# Altium project Gateway_V1.PrjPcb
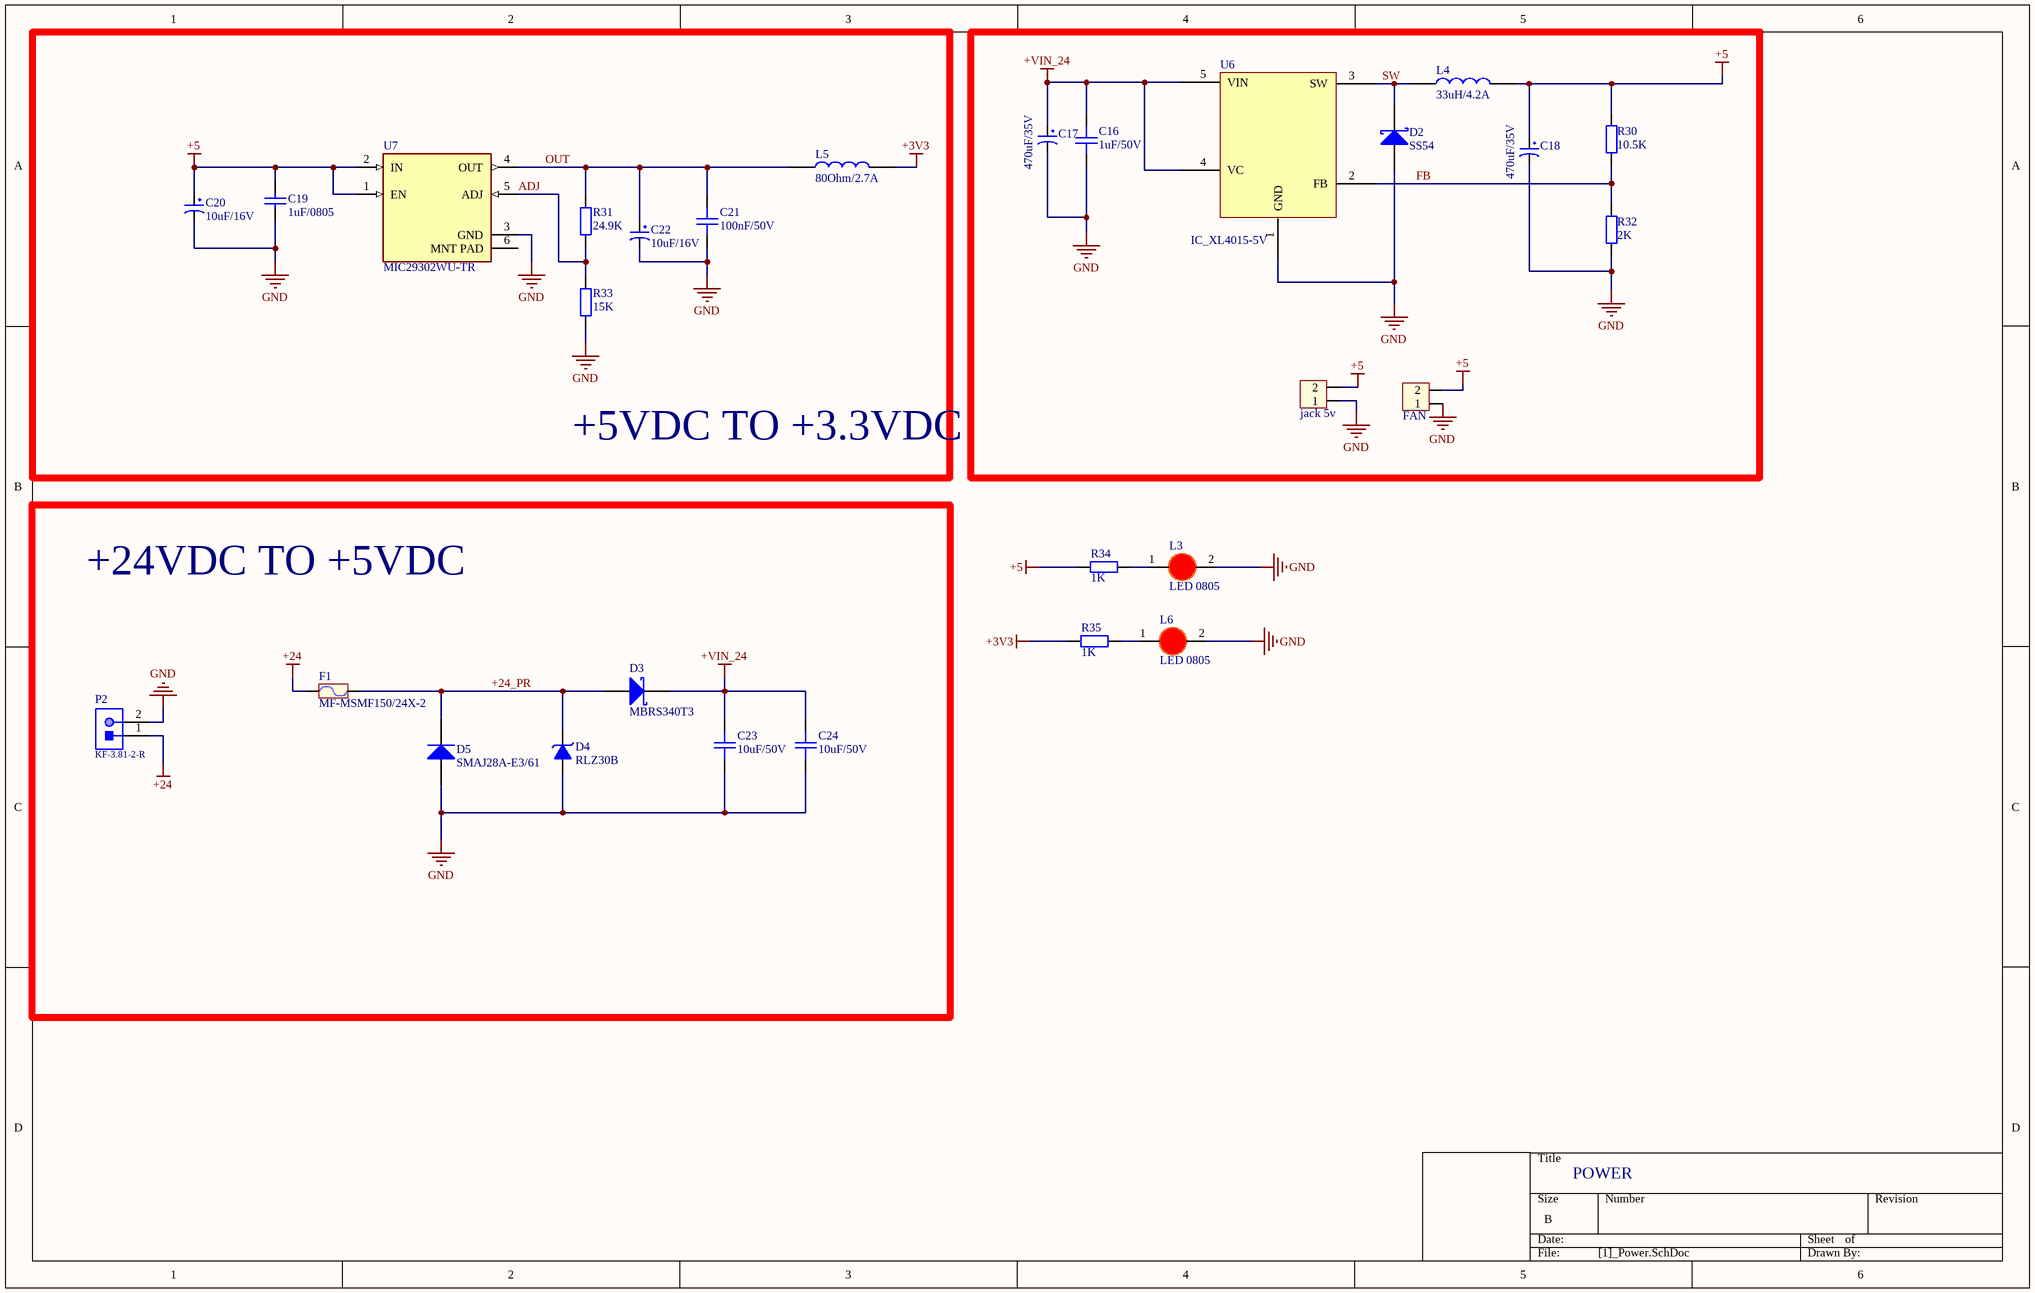
[diagram p0: [1]_Power.SchDoc]
4 sheets, 108 parts. Net scope: global (net labels, ports and power ports of the same name join across sheets).
Board file: PCB_Gateway.PcbDoc
Sheets:
  [1]_Power.SchDoc
  [2]_ARM.SchDoc
  [3]_I2C_TO_UART.SchDoc
  [4]_SIM.SchDoc

## Sheet [1]_Power.SchDoc
size B

### Parts
C16  1uF/50V  [1206]
C17  470uF/35V  [CAP_10_10]
C18  470uF/35V  [CAP_10_10]
C19  1uF/0805  [tu 0805]
C20  10uF/16V  [2312]
C21  100nF/50V  [C0805]
C22  10uF/16V  [2312]
C23  10uF/50V  [1210]
C24  10uF/50V  [1210]
D2  SS54  [DO-SMB-2]
D3  MBRS340T3  [DO214AB_SMC]
D4  RLZ30B  [SOD_80]
D5  SMAJ28A-E3/61  [VISH-DO-214AC-2_L]
F1  MF-MSMF150/24X-2  [1812]
H1  jack 5v  [VH3.96M-2]
H2  FAN  [XH2.54M-2]
L3  LED 0805  [LED-0805-Red]
L4  33uH/4.2A  [IND-12_12_8]
L5  80Ohm/2.7A  [FER-0805 (2012)]
L6  LED 0805  [LED-0805-Red]
P2  KF-3.81-2-R  [691322310002]
R30  10.5K  [R1206]
R31  24.9K  [tro smd 0805]
R32  2K  [R0805]
R33  15K  [tro smd 0805]
R34  1K  [R0805]
R35  1K  [R0805]
U6  IC_XL4015-5V  [TO-263-5]
U7  MIC29302WU-TR  [FP-C04-012-MFG]

### Blocks framed on the sheet
+5VDC TO +3.3VDC: C19-C22 L5 R31 R33 U7
+24VDC TO +5VDC: C23 C24 D3-D5 F1 P2

### Nets
+3V3: L5.2 R35.2
+5: C18.1 C19.1 C20.1 H1.2 H2.2 L4.2 R30.1 R34.2 U7.1(EN) U7.2(IN)
+24: F1.1 P2.1
+VIN_24: C16.2 C17.1 C23.2 C24.2 D3.2(K) U6.4(VC) U6.5(VIN)
GND: C16.1 C17.2 C18.2 C19.2 C20.2 C21.1 C22.2 C23.1 C24.1 D2.1(A) D4.1(A) D5.2(A) H1.1 H2.1 L3.2(K) L6.2(K) P2.2 R32.1 R33.1 U6.1(GND) U7.3(GND)
+24_PR: D3.1(A) D4.2(K) D5.1(K) F1.2
ADJ: R31.1 R33.2 U7.5(ADJ)
FB: R30.2 R32.2 U6.2(FB)
OUT: C21.2 C22.1 L5.1 R31.2 U7.4(OUT)
SW: D2.2(K) L4.1 U6.3(SW)
NetL3_1: L3.1(A) R34.1
NetL6_1: L6.1(A) R35.1

Not connected (* = marked no-connect by the designer): U7 6(MNT_PAD)

### Notes on the sheet
- POWER

### Library data of the parts
C16 = CAP_CER_1206_1uF: CAP CER 10uF/50V 1206; Manufacturer: Samsung; Part number: C1206; Cost: 500; ComponentLink1Description: Link product; ComponentLink1URL: https://www.thegioiic.com/tu-gom-1206-1uf-50v; Package: 1206
C17 C18 = CAP_ALUM_10_10_33uF/100V: CAP ALUM 33uF/100V 10x10.5; Manufacturer: OEM; Part number: ALUM_33uF; Cost: 2900; ComponentLink1Description: Link product; ComponentLink1URL: https://www.thegioiic.com/tu-nhom-smd-33uf-100v-10x10-5mm; Package: 10x10.5
C19 = Tu 0805 104 50V 10%: Dán; Don_Vi: Con; So_Chan: 2; Ten_Linh_Kien: Tụ 0805 104-100nF 10% 50V; Ma_Hang: MH004551; Chung_Loai: Dán; Kieu_Chan: *; ComponentLink1Description: New link; ComponentLink1URL: https://www.thegioiic.com/tu-gom-0805-1uf-25v
C20 C22 = CAP_TANT_2312_100uF: CAP TANT 100uF/10V 2312; Manufacturer: AVX; Part number: TAJC107K010RNJ; Cost: 5000; ComponentLink1Description: Link product; ComponentLink1URL: https://www.thegioiic.com/tu-tantalum-100uf-10v-2312-tajc107k010rnj; Package: 2312
C21 = CAP_CER_0805_100nF: CAP CER 100nF/50V 0805; Manufacturer: Samsung; Cost: 190; Part number: C0805; ComponentLink1Description: Link product; ComponentLink1URL: https://www.thegioiic.com/tu-gom-0805-100nf-0-1uf-50v; Package: 0805
C23 C24 = CAP_CER_1210_10uF: CAP CER 10uF/50V 1210; Manufacturer: Yageo; Part number: C1210; Cost: 3400; ComponentLink1Description: Link product; ComponentLink1URL: https://www.thegioiic.com/tu-gom-1210-10uf-50v; Package: 1210
D2 = DIO_SS54: DIODE SCHOTTKY 5A 40V SMB; Manufacturer: Vishay; Cost: 1800; Part number: SS54; Package: SMB; ComponentLink1Description: Link product; ComponentLink1URL: https://www.thegioiic.com/ss54-smb
D3 = DIO_MBRS340T3: DIODE SCHOTTKY 4A 40V SMC DO-214AB; Manufacturer: Fairchild; Part number: SS14; Cost: 2000; Package: DO-214AB; ComponentLink1Description: Link product; ComponentLink1URL: https://www.thegioiic.com/mbrs340t3-diode-schottky-4a
D4 = DIO_ZMM15: ZMM15 15V 500mW SMD SOD-80; Manufacturer: On Semiconductor; Cost: 250; Part number: ZMM15; Package: SOD-80 2L; ComponentLink1Description: Link product; ComponentLink1URL: https://www.thegioiic.com/rlz30b-diode-zener-27-70-29-13v-500mw-smd
D5 = CMP-0548-00227-2: Transient Voltage Suppressor, 6.40 to 231 V, 28 V Stand-off Voltage, Uni-Directional, -55 to 155 degC, 2-pin DO-214AC, Pb-Free, Tape and Reel; Manufacturer: Vishay Semiconductor; IFSM: 40 A; VBR Uni-Directional (V): 6.4 to 231; ID (uA): 1; VWM (V): 28; PPPM (W): 400, 300; PackageReference: DO-214AC-2; Packing: Tape and Reel; RoHS: TRUE; PartNumber: SMAJ28A-E3/61; PackageDescription: 2-Pin DO-214AC (SMA), Body 4.245 x 2.665 mm; Mounting Technology: Surface Mount; DatasheetVersion: 12/8/2013; Operating Junction and Storage Temperature Range: -55 to 150 degC; ComponentLink4Description: New link; ComponentLink4URL: https://www.thegioiic.com/smaj28a-e3-61-tvs-diode-28v-45-4v-do214ac
F1 = FUSE_16V_2.5A: MF-MSMF250/16 16V 2.5A1812; Manufacturer: Bourns; Cost: 3000; Part number: 1812; ComponentLink1Description: Link product; ComponentLink1URL: https://www.thegioiic.com/mf-msmf150-24x-2-cau-chi-tu-phuc-hoi-1812-24v-1-5a; Package: 1812
H1 = Header 2P VH3.96 Duc Thang: Cắm; Ten_Linh_Kien: Header 2P XH2.54-2P Đực Thẳng; Don_Vi: Con; Ma_Hang: MH001283; Chung_Loai: Cắm
H2 = Header 2P 2.54 Duc Thang: Cắm; Ten_Linh_Kien: Header 2P XH2.54-2P Đực Thẳng; Don_Vi: Con; Ma_Hang: MH001283; Chung_Loai: Cắm
L3 L6 = LED 0805 Do: Dán; Don_Vi: Con; Ma_Hang: MH000897; Ten_Linh_Kien: LED 0805 Màu Đỏ (Red); Ghi_Chu: *; Kieu_Chan: *; Chung_Loai: Dán
L4 = IND_33uH_4.2A_1280: CDRH127 IND 33uH 4.2A 12x12x8; Manufacturer: OEM; Cost: 3200; Part number: CDRH127; Package: 1280; ComponentLink1Description: Link product; ComponentLink1URL: https://www.thegioiic.com/cdrh127-cuon-cam-dan-smd-1280-330-33uh-4-2a
L5 = FERRITE_BEAD_2.7A_80: FERRITE BEAD 2.7A 80 OHM 0805; Manufacturer: Taiyo Yuden; Part number: FBMH2012HM800-T; Cost: 2000; Package: 0805; ComponentLink1Description: Link product; ComponentLink1URL: https://www.thegioiic.com/fbmh2012hm800-t-ferrite-bead-80-ohm-0805
P2 = CMP-1502-01886-1: Serie 322 - 3.81mm Horizontal PCB Header WR-TBL, 2 pin; Manufacturer: Wurth Elektronik; Gender: Male; Pin Number: 2; Publisher: WurthElektronik; Pitch: 3.81mm; Packaging: Box; Part Number: 691322310002; Manufacturer URL: http://www.we-online.de; Operating Temperature: -40to105degC; Mounting Technology: THT; Datasheet URL: http://katalog.we-online.de/em/datasheet/6913223100xx.pdf; Package Reference: 691322310002
R30 = RES_1206_3.3K: RES 1206 3.3K; Manufacturer: OEM; Cost: 116; Part number: R1206; ComponentLink1Description: Link product; ComponentLink1URL: https://www.thegioiic.com/dien-tro-3-3-kohm-1206-1-; Package: 1206
R31 = Tro 0805 5% 20k: Dán; Don_Vi: Con; So_Chan: 2; Ten_Linh_Kien: Trở 0805 5% 20k; Ma_Hang: MH005247; Chung_Loai: Dán; Kieu_Chan: *; ComponentLink1Description: New link; ComponentLink1URL: https://www.thegioiic.com/dien-tro-100-kohm-0805-1
R32 R34 R35 = RES_0805_0K: RES 0805 0K; Manufacturer: OEM; Cost: 48; Part number: R0805; ComponentLink1Description: Link product; ComponentLink1URL: https://www.thegioiic.com/dien-tro-2-kohm-0805-1; Package: 0805
R33 = Tro 0805 5% 47k: Dán; Don_Vi: Con; So_Chan: 2; Ten_Linh_Kien: Trở 0805 5% 47k; Ma_Hang: MH005320; Chung_Loai: Dán; Kieu_Chan: *; ComponentLink1Description: New link; ComponentLink1URL: https://www.thegioiic.com/dien-tro-43-kohm-0805-5
U6 = IC_XL4015-5V: XL4015E1 Buck converter 5A TO 263; Manufacturer: XLSEMI; Cost: 16000; Part number: XL4015E1; ComponentLink1Description: Link product; ComponentLink1URL: https://www.thegioiic.com/xl4015e1-ic-dieu-chinh-giam-ap-5a-to-263-5; Package: TO-263-5
U7 = CMP-06324-000007-1: IC REG LINEAR POS ADJ 3A TO263-5; Manufacturer: Microchip; Output Voltage: 3.3-12V; Output Type: AdjustableProgrammable; Max Junction Temp: +125°C; Standoff Height: 0mm; Accuracy Percentage: 1%; Max Supply Voltage: 26V; Nominal Supply Current: 10-37mA; Number Of Outputs: 1; Dropout Voltage: 370mV; Min Supply Voltage: 2.25V; Device Class L1: Integrated Circuits (ICs); Digikey Description: IC REG LINEAR POS ADJ 3A TO263-5; Device Class L2: Power Management ICs; Lead Free: Yes; Mouser Description: LDO Voltage Regulators; Package: C04-012; Temperature: -40°C to +125°C; Temperature Range High: +125°C; Automotive: No; Device Class L3: Voltage Regulators - Linear; Category: IC; Temperature Range Low: -40°C; RoHS: TRUE; Output Current: 3A; Octopart: https://octopart.com/mic29302wu-tr-microchip-66801318; Manufacturer Part Number: MIC29302WU-TR; Height: 0.2inch; ComponentLink3Description: New link; ComponentLink3URL: https://www.thegioiic.com/mic29302-ic-dieu-chinh-dien-ap-3a

## Sheet [2]_ARM.SchDoc
size B
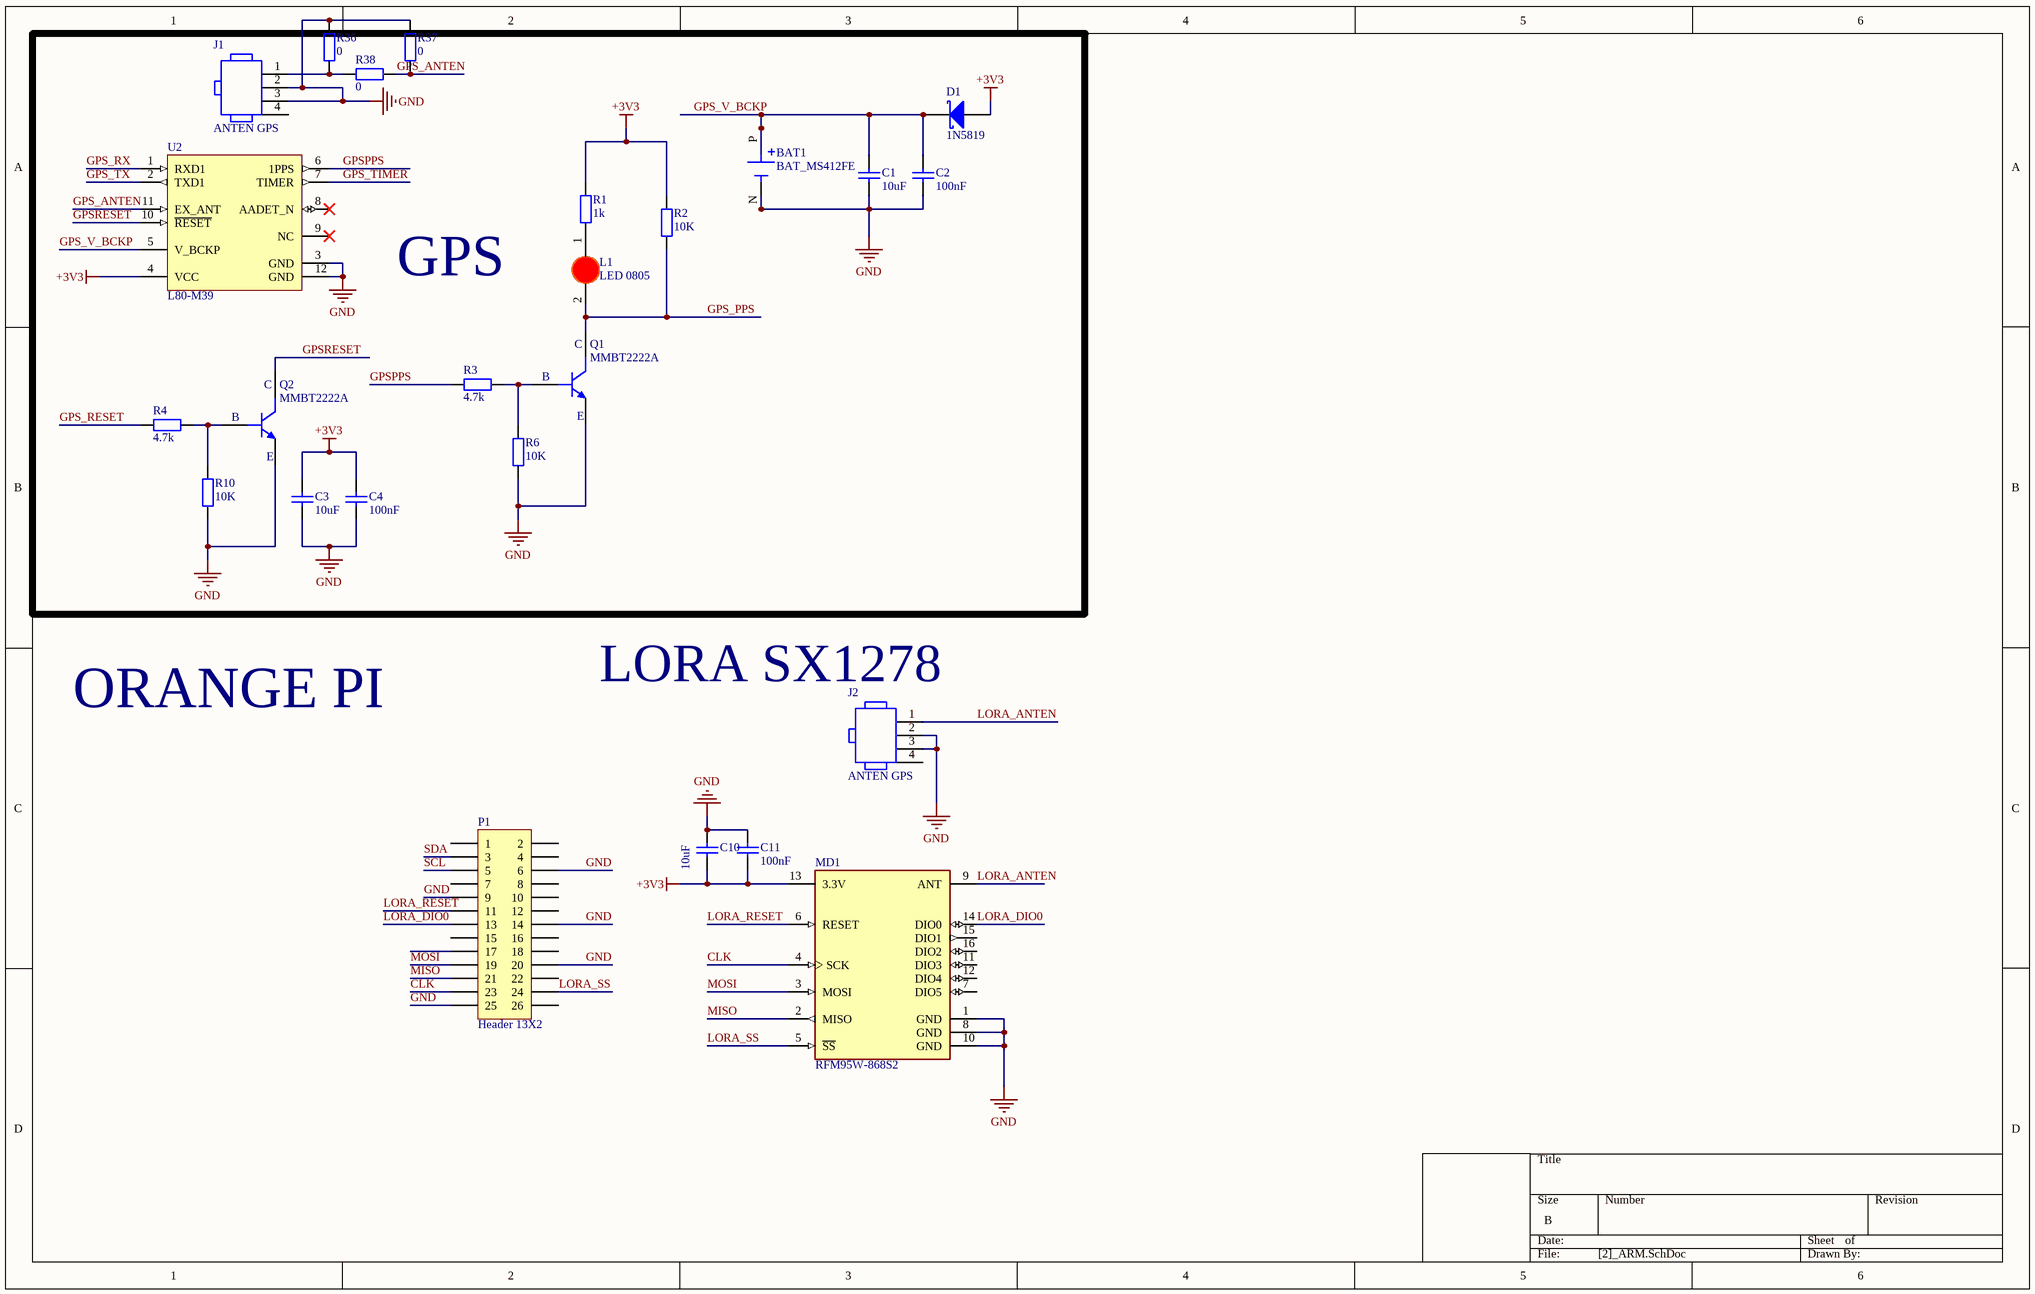
[diagram p1: [2]_ARM.SchDoc]

### Parts
BAT1  BAT_MS412FE  [MS412FE]
C1  10uF  [tu 0603]
C2  100nF  [tu 0603]
C3  10uF  [tu 0603]
C4  100nF  [tu 0603]
C10  10uF  [tu 0603]
C11  100nF  [tu 0603]
D1  1N5819  [DO-214AA]
J1  ANTEN GPS  [TG-RECE-20369-001E-4_V]
J2  ANTEN GPS  [TG-RECE-20369-001E-4_V]
L1  LED 0805  [LED-0805-Red]
MD1  RFM95W-868S2  [FP-RFM95W-868S2-MFG]
P1  Header 13X2  [HDR2X13]
Q1  MMBT2222A  [SOT_23_3]
Q2  MMBT2222A  [SOT_23_3]
R1  1k  [tro smd 0603]
R2  10K  [tro smd 0603]
R3  4.7k  [tro smd 0603]
R4  4.7k  [tro smd 0603]
R6  10K  [tro smd 0603]
R10  10K  [tro smd 0603]
R36  0  [tro smd 0603]
R37  0  [tro smd 0603]
R38  0  [tro smd 0603]
U2  L80-M39  [QUEC-L80-M39-12_V]

### Blocks framed on the sheet
GPS: BAT1 C1-C4 D1 J1 L1 Q1 Q2 R1-R4 R6 R10 R36-R38 U2

### Nets
+3V3: C3.2 C4.1 C10.2 C11.2 D1.1(A) MD1.13(3.3V) R1.2 R2.2 U2.4(VCC)
GND: BAT1.N(NEG) C1.1 C2.2 C3.1 C4.2 C10.1 C11.1 J1.2 J1.3 J2.2 J2.3 MD1.1(GND) MD1.8(GND) MD1.10(GND) P1.6 P1.9 P1.14 P1.20 P1.25 Q1.2(E) Q2.2(E) R6.1 R10.1 R36.2 R37.2 U2.3(GND) U2.12(GND)
CLK: MD1.4(SCK) P1.23
GPS_ANTEN: R37.1 R38.1 U2.11(EX_ANT)
GPS_PPS: L1.2(K) Q1.3(C) R2.1
GPS_RESET: R4.1
GPS_RX: U2.1(RXD1)
GPS_TIMER: U2.7(TIMER)
GPS_TX: U2.2(TXD1)
GPS_V_BCKP: BAT1.P(POS) C1.2 C2.1 D1.2(K) U2.5(V_BCKP)
GPSPPS: R3.1 U2.6(1PPS)
GPSRESET: Q2.3(C) U2.10(~{RESET})
LORA_ANTEN: J2.1 MD1.9(ANT)
LORA_DIO0: MD1.14(DIO0) P1.13
LORA_RESET: MD1.6(RESET) P1.11
LORA_SS: MD1.5(~{SS}) P1.24
MISO: MD1.2(MISO) P1.21
MOSI: MD1.3(MOSI) P1.19
SCL: P1.5
SDA: P1.3
NetJ1_1: J1.1 R36.1 R38.2
NetL1_1: L1.1(A) R1.1
NetQ1_1: Q1.1(B) R3.2 R6.2
NetQ2_1: Q2.1(B) R4.2 R10.2

Not connected (* = marked no-connect by the designer): J1 4; J2 4; MD1 7(DIO5) 11(DIO3) 12(DIO4) 15(DIO1) 16(DIO2); P1 1 2 4 7 8 10 12 15 16 17 18 22 26; U2 8(AADET_N)* 9(NC)*

### Notes on the sheet
- (near J2) LORA SX1278
- ORANGE PI

### Library data of the parts
C1 C3 C10 = Tu 0603 105 16V 20%: Dán; Don_Vi: Con; So_Chan: 2; Ten_Linh_Kien: Tụ 0603 105-1uF 20% 16V; Ma_Hang: MH004574; Chung_Loai: Dán; Kieu_Chan: *
C2 C4 C11 = Tu 0603 104 50V 10%: Dán; Don_Vi: Con; So_Chan: 2; Ten_Linh_Kien: Tụ 0603 104-100nF 10% 50V; Ma_Hang: MH004568; Chung_Loai: Dán; Kieu_Chan: *
D1 = DIO_SS14: DIODE SCHOTTKY 1A 40V SMA DO-214AA; Manufacturer: Fairchild; Part number: SS14; Cost: 600; Package: DO-214AA; ComponentLink1Description: Link product; ComponentLink1URL: https://www.thegioiic.com/ss14-sma-diode-schottky-1a-1n5819
J1 J2 = CMP-0275-00001-2: RF Connector, Onboard Receptacle, IPEX MHFIII; Manufacturer: Taoglas; PartNumber: RECE-20369-001E-01; Packing: Tape and Reel; Mounting Technology: Surface Mount; PackageReference: RECE-20369-001E-01-4; ComponentLink1URL: http://www.taoglas.com/; Housing Color: Gold; DatasheetVersion: Rev. C; ComponentLink2URL: http://www.taoglas.com/images/product_images/original_images/RECE.20369.001E.01.pdf; ComponentLink3Description: Package Specification; PackageVersion: Rev. C; ComponentLink1Description: Manufacturer URL; ComponentLink2Description: Datasheet; PackageDescription: 4-Pin, Hand Drawn, Body 1.7x1.7mm; ComponentLink3URL: http://www.taoglas.com/images/product_images/original_images/RECE.20369.001E.01.pdf
L1 = LED 0805 Do: as L3 on sheet [1]_Power; Ghi_Chu: *; Kieu_Chan: *; Chung_Loai: Dán
MD1 = CMP-204316-000001-1: RX TXRX MODULE ISM < 1GHZ SMD; Data Rate: 300Kbps; Frequency: 868MHz; Sensitivity: -123dBm; Interface: SPI; Current - Transmitting: 120mA; Current - Receiving: 12.1mA; Max Operating Temperature: 70°C; Case/Package: SMD/SMT; Packaging: Bulk; Mount: Surface Mount; Min Operating Temperature: -20°C
P1 = Header 13X2: Header, 13-Pin, Dual row; LatestRevisionDate: 17-Jul-2002; LatestRevisionNote: Re-released for DXP Platform.; Publisher: Altium Limited
Q1 Q2 = BJT_NPN_MMBT2222A: MMBT2222A NPN 40V 0.6A; Manufacturer: OEM; Cost: 500; Part number: MMBT2222A; ComponentLink1Description: Link product; ComponentLink1URL: https://www.thegioiic.com/mmbt2222a-transistor-npn-40v-0-6a-3-chan-sot-23; Package: SOT-23
R1-R4 R6 R10 R36-R38 = Tro 0603 1% 4.3 k: Dán; Don_Vi: Con; So_Chan: 2; Ten_Linh_Kien: Trở 0603 1% 4.3k; Ma_Hang: MH008715; Chung_Loai: Dán; Kieu_Chan: *
U2 = CMP-2000-05325-1: GPS Module L80 Hardware Design, 1575.42 MHz, 3 to 4.3 V, -40 to 85 degC, 12-Pin SMD, RoHS, Tape and Reel; Manufacturer: Quectel; Maximum Operating Supply Voltage: 4.3V; Screening Level: ExtendedIndustrial; Typical Operating Supply Voltage: 3.3V; Minimum Operating Supply Voltage: 3V; Manufacturer URL: http://www.quectel.com/; Mounting: SurfaceMount; Maximum Operating Frequency: 1575.42MHz; Datasheet Version: Rev. V1.1, 08/2013; Datasheet URL: http://www.quectel.com/uploadimage/downlad/l80_hardware_design_v1.1.pdf

## Sheet [3]_I2C_TO_UART.SchDoc
size B
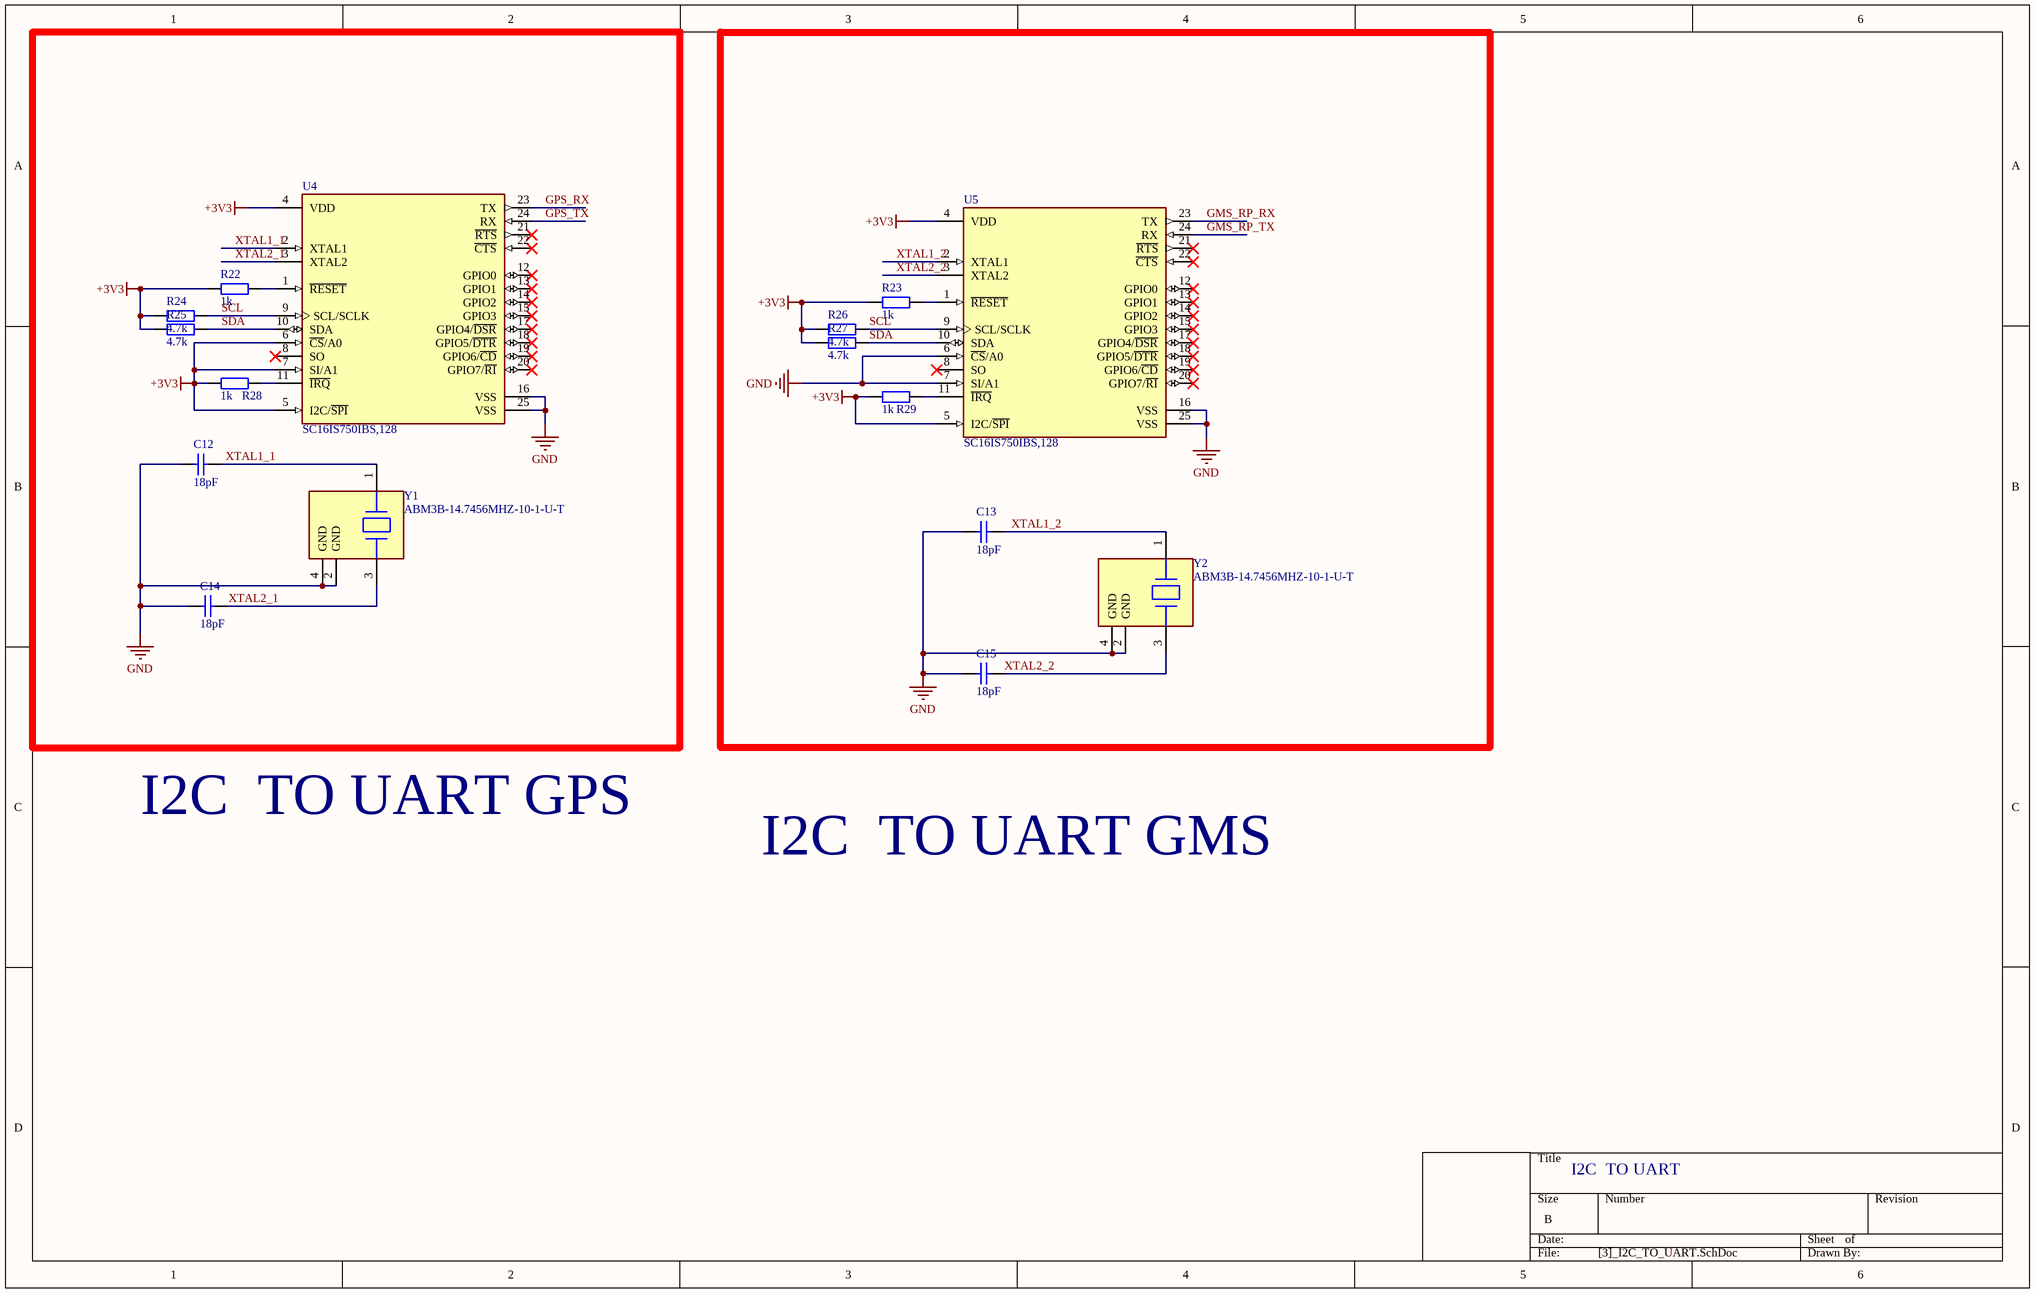
[diagram p2: [3]_I2C_TO_UART.SchDoc]

### Parts
C12  18pF  [tu 0603]
C13  18pF  [tu 0603]
C14  18pF  [tu 0603]
C15  18pF  [tu 0603]
R22  1k  [tro smd 0603]
R23  1k  [tro smd 0603]
R24  4.7k  [tro smd 0603]
R25  4.7k  [tro smd 0603]
R26  4.7k  [tro smd 0603]
R27  4.7k  [tro smd 0603]
R28  1k  [tro smd 0603]
R29  1k  [tro smd 0603]
U4  SC16IS750IBS,128  [FP-SOT616-3-MFG]
U5  SC16IS750IBS,128  [FP-SOT616-3-MFG]
Y1  ABM3B-14.7456MHZ-10-1-U-T  [FP-ABM3B-MFG]
Y2  ABM3B-14.7456MHZ-10-1-U-T  [FP-ABM3B-MFG]

### Nets
+3V3: R22.1 R23.1 R24.1 R25.1 R26.1 R27.1 R28.1 R29.1 U4.4(VDD) U4.5(I2C/~{SPI}) U4.6(~{CS}/A0) U4.7(SI/A1) U5.4(VDD) U5.5(I2C/~{SPI})
GND: C12.2 C13.2 C14.2 C15.2 U4.16(VSS) U4.25(VSS) U5.6(~{CS}/A0) U5.7(SI/A1) U5.16(VSS) U5.25(VSS) Y1.2(GND) Y1.4(GND) Y2.2(GND) Y2.4(GND)
GMS_RP_RX: U5.23(TX)
GMS_RP_TX: U5.24(RX)
GPS_RX: U4.23(TX)
GPS_TX: U4.24(RX)
SCL: R24.2 R26.2 U4.9(SCL/SCLK) U5.9(SCL/SCLK)
SDA: R25.2 R27.2 U4.10(SDA) U5.10(SDA)
XTAL1_1: C12.1 U4.2(XTAL1) Y1.1
XTAL1_2: C13.1 U5.2(XTAL1) Y2.1
XTAL2_1: C14.1 U4.3(XTAL2) Y1.3
XTAL2_2: C15.1 U5.3(XTAL2) Y2.3
NetR22_2: R22.2 U4.1(~{RESET})
NetR23_2: R23.2 U5.1(~{RESET})
NetR28_2: R28.2 U4.11(~{IRQ})
NetR29_2: R29.2 U5.11(~{IRQ})

Not connected (* = marked no-connect by the designer): U4 8(SO)* 12(GPIO0)* 13(GPIO1)* 14(GPIO2)* 15(GPIO3)* 17(GPIO4/~{DSR})* 18(GPIO5/~{DTR})* 19(GPIO6/~{CD})* 20(GPIO7/~{RI})* 21(~{RTS})* 22(~{CTS})*; U5 8(SO)* 12(GPIO0)* 13(GPIO1)* 14(GPIO2)* 15(GPIO3)* 17(GPIO4/~{DSR})* 18(GPIO5/~{DTR})* 19(GPIO6/~{CD})* 20(GPIO7/~{RI})* 21(~{RTS})* 22(~{CTS})*

### Notes on the sheet
- I2C  TO UART GPS
- I2C  TO UART GMS
- I2C  TO UART

### Library data of the parts
C12-C15 = Tu 0603 22pF 50V 10%: Dán; Don_Vi: Con; So_Chan: 2; Ten_Linh_Kien: Tụ 0603 22pF 50V 10%; Ma_Hang: MH004570; Chung_Loai: Dán; Kieu_Chan: *
R22-R29 = Tro 0603 1% 1k: Dán; So_Chan: 2; Don_Vi: Con; Ten_Linh_Kien: Trở 0603 1% 1k; Ma_Hang: MH006334; Chung_Loai: Dán; Kieu_Chan: *
U4 U5 = CMP-1651-00009-2: IC UART I2C/SPI 24-HVQFN; Max Supply Voltage: 3.6V; Data Rate: 5Mbps; Max Supply Current: 6mA; Memory Size: 64B; Min Supply Voltage: 2.3V; Operating Supply Voltage: 3.3V; Number of Channels: 1; Min Operating Temperature: -40°C; Mount: Surface Mount; Lead Free: Lead Free; Nominal Supply Current: 6mA; Number of Pins: 24; Max Operating Temperature: 95°C; Packaging: Tape and Reel; Package Quantity: 1500; Radiation Hardening: No; Operating Supply Current: 6mA
Y1 Y2 = CMP-27762-009747-1: Crystal 14.7456MHz ±10ppm 10pF SMD-4 5mm x 3.2mm; ESR (Equivalent Series Resistance): 70R; Operating Frequency: 14.7456 MHz; Min Operating Temperature: -10°C; Width: 0.126inch; Frequency Tolerance: 10ppm; REACH SVHC: No SVHC; Max Operating Temperature: 60°C; Termination: SMD/SMT; Load Capacitance: 10pF; Series: ABM3B; Frequency Stability: 10ppm; Mount: Surface Mount; Depth: 3.2mm; Package Quantity: 1000; Series Resistance: 70R; Frequency: 14.7456MHz; Number of Pins: 4; Packaging: Tape and Reel; Resistor Type: Ceramic; Tolerance: 10ppm; Height: 0.043inch; Length: 5mm; Case/Package: CSMD; Lead Free: Lead Free

## Sheet [4]_SIM.SchDoc
size B
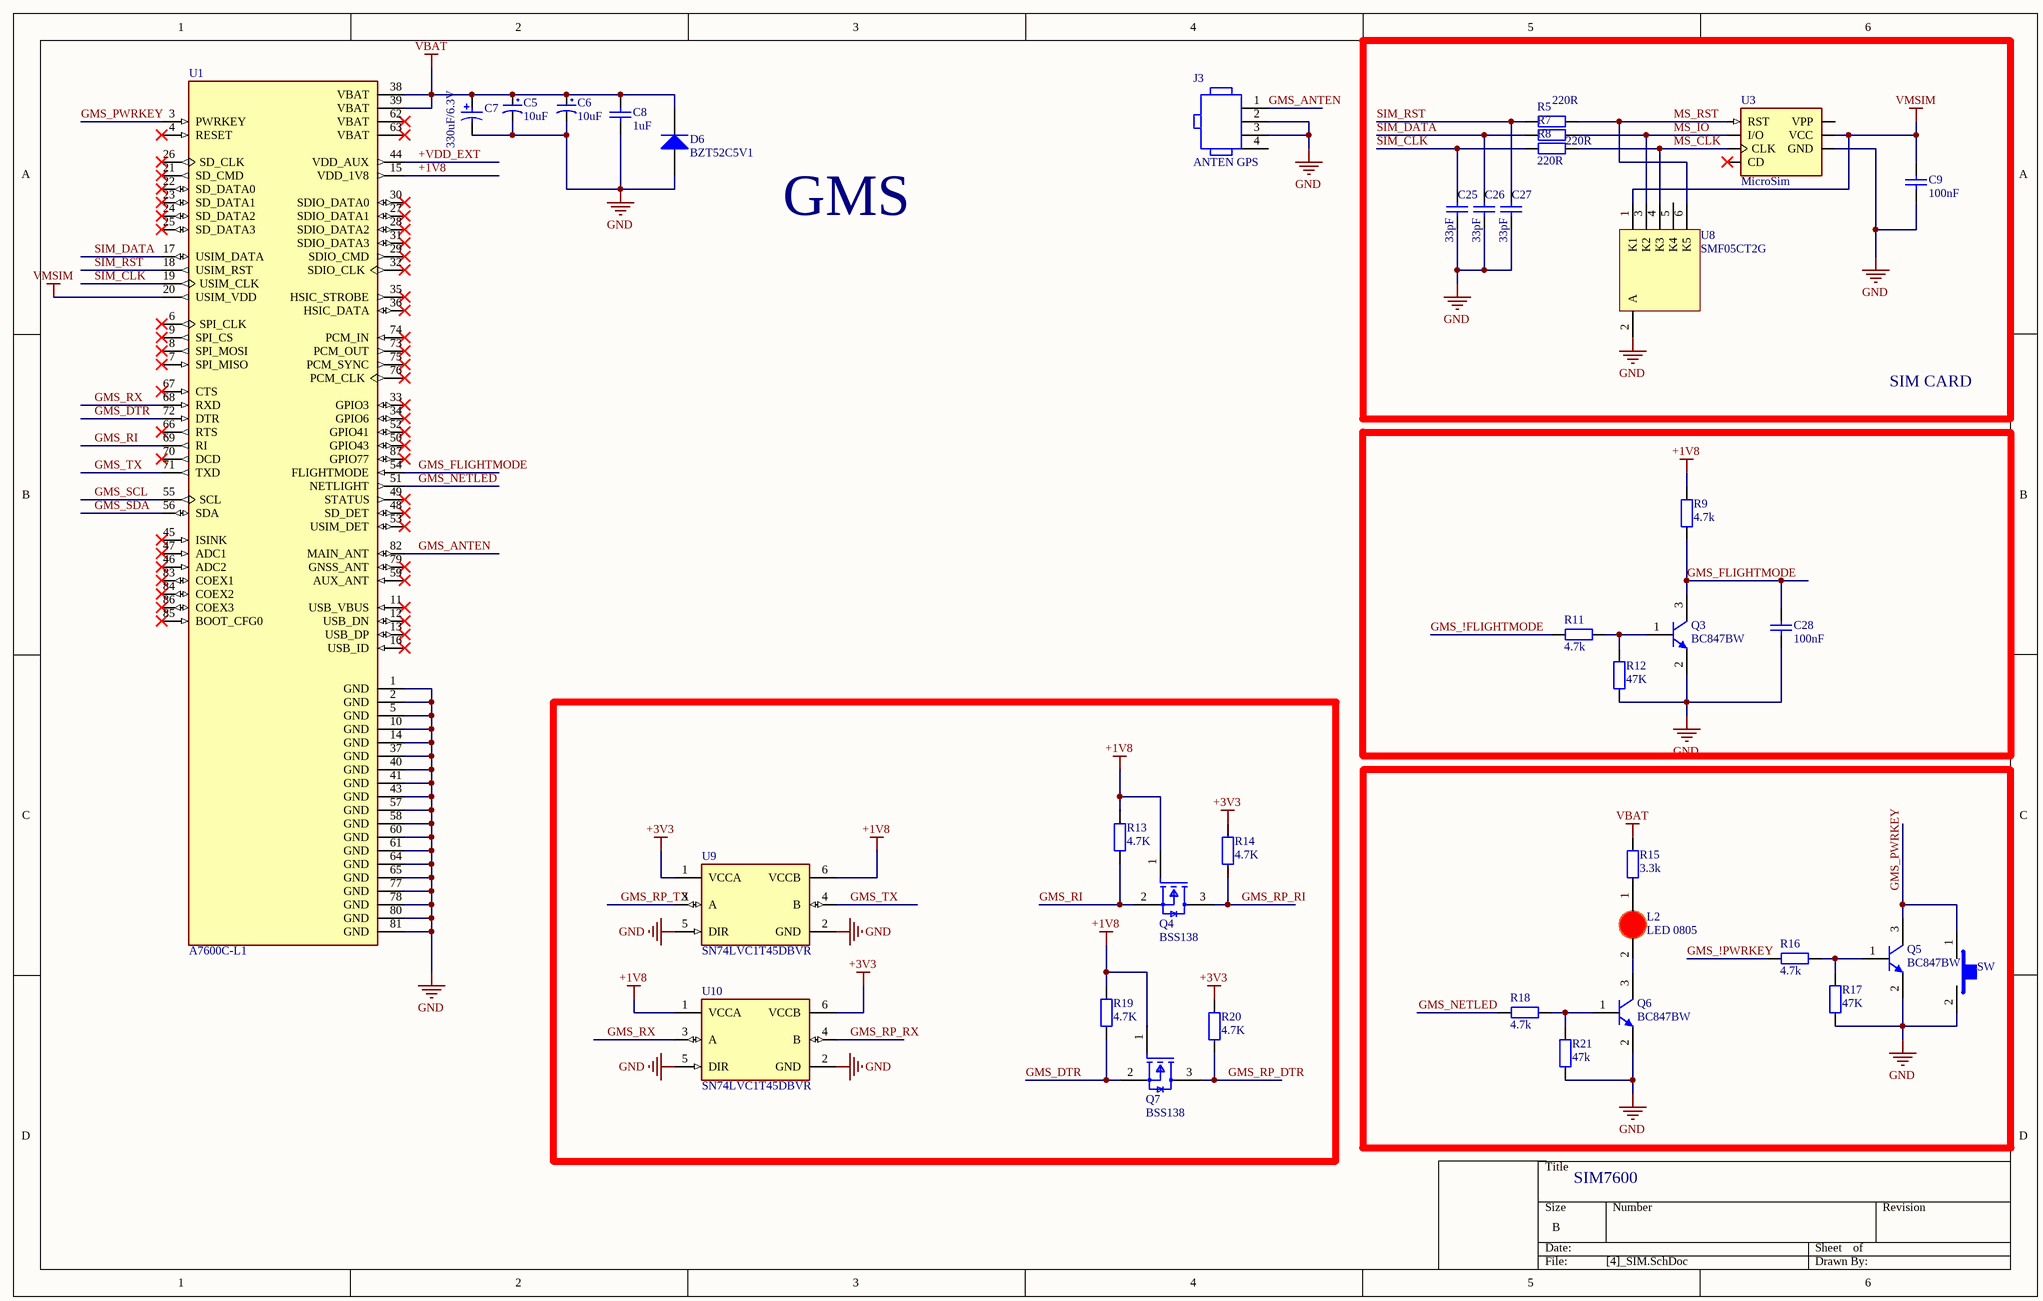
[diagram p3: [4]_SIM.SchDoc]

### Parts
C5  10uF  [tu tantalum smd3528]
C6  10uF  [tu tantalum smd3528]
C7  330uF/6.3V  [NIC-CAPA2-6.3X7.7_V]
C8  1uF  [tu 0603]
C9  100nF  [tu 0603]
C25  33pF  [tu 0603]
C26  33pF  [tu 0603]
C27  33pF  [tu 0603]
C28  100nF  [tu 0603]
D6  BZT52C5V1  [DIODE SOD-123]
J3  ANTEN GPS  [TG-RECE-20369-001E-4_V]
L2  LED 0805  [LED-0805-Red]
Q3  BC847BW  [INF-SOT323_N]
Q4  BSS138  [FP-SOT23-IPC_C]
Q5  BC847BW  [INF-SOT323_N]
Q6  BC847BW  [INF-SOT323_N]
Q7  BSS138  [FP-SOT23-IPC_C]
R5  220R  [tro smd 0603]
R7  220R  [tro smd 0603]
R8  220R  [tro smd 0603]
R9  4.7k  [tro smd 0603]
R11  4.7k  [tro smd 0603]
R12  47K  [tro smd 0603]
R13  4.7K  [tro smd 0603]
R14  4.7K  [tro smd 0603]
R15  3.3k  [tro smd 0603]
R16  4.7k  [tro smd 0603]
R17  47K  [tro smd 0603]
R18  4.7k  [tro smd 0603]
R19  4.7K  [tro smd 0603]
R20  4.7K  [tro smd 0603]
R21  47k  [tro smd 0603]
SW  Tactile  [SW 2P SMD]  (value not drawn)
U1  A7600C-L1  [SIMA7600C]
U3  MicroSim  [Micro-Sim-7P]
U8  SMF05CT2G  [ONSC-SC70-6-419B-02_W_V]
U9  SN74LVC1T45DBVR  [FP-DBV0006A-IPC_B]
U10  SN74LVC1T45DBVR  [FP-DBV0006A-IPC_B]

### Blocks framed on the sheet
SIM CARD: C9 C25-C27 R5 R7 R8 U3 U8

### Nets
+1V8: Q4.1(G) Q7.1(G) R9.2 R13.1 R19.1 U1.15(VDD_1V8) U9.6(VCCB) U10.1(VCCA)
+3V3: R14.2 R20.2 U9.1(VCCA) U10.6(VCCB)
GND: C5.2 C6.2 C7.2 C8.2 C9.2 C25.2 C26.2 C27.2 C28.2 D6.1(A) J3.2 J3.3 Q3.2(E) Q5.2(E) Q6.2(E) R12.1 R17.1 R21.1 SW.2 U1.1(GND) U1.2(GND) U1.5(GND) U1.10(GND) U1.14(GND) U1.37(GND) U1.40(GND) U1.41(GND) U1.43(GND) U1.57(GND) U1.58(GND) U1.60(GND) U1.61(GND) U1.64(GND) U1.65(GND) U1.77(GND) U1.78(GND) U1.80(GND) U1.81(GND) U3.C5(GND) U8.2(A) U9.2(GND) U9.5(DIR) U10.2(GND) U10.5(DIR)
VBAT: C5.1 C6.1 C7.1 C8.1 D6.2(K) R15.2 U1.38(VBAT) U1.39(VBAT)
VMSIM: C9.1 U1.20(USIM_VDD) U3.C1(VCC) U8.1(K1)
+VDD_EXT: U1.44(VDD_AUX)
GMS_!FLIGHTMODE: R11.1
GMS_!PWRKEY: R16.1
GMS_ANTEN: J3.1 U1.82(MAIN_ANT)
GMS_DTR: Q7.2(S) R19.2 U1.72(DTR)
GMS_FLIGHTMODE: C28.1 Q3.3(C) R9.1 U1.54(FLIGHTMODE)
GMS_NETLED: R18.1 U1.51(NETLIGHT)
GMS_PWRKEY: Q5.3(C) SW.1 U1.3(PWRKEY)
GMS_RI: Q4.2(S) R13.2 U1.69(RI)
GMS_RP_DTR: Q7.3(D) R20.1
GMS_RP_RI: Q4.3(D) R14.1
GMS_RP_RX: U10.4(B)
GMS_RP_TX: U9.3(A)
GMS_RX: U1.68(RXD) U10.3(A)
GMS_SCL: U1.55(SCL)
GMS_SDA: U1.56(SDA)
GMS_TX: U1.71(TXD) U9.4(B)
MS_CLK: R8.2 U3.C3(CLK) U8.4(K3)
MS_IO: R7.2 U3.C7(I/O) U8.3(K2)
MS_RST: R5.2 U3.C2(RST) U8.6(K5)
SIM_CLK: C25.1 R8.1 U1.19(USIM_CLK)
SIM_DATA: C26.1 R7.1 U1.17(USIM_DATA)
SIM_RST: C27.1 R5.1 U1.18(USIM_RST)
NetL2_1: L2.1(A) R15.1
NetL2_2: L2.2(K) Q6.3(C)
NetQ3_1: Q3.1(B) R11.2 R12.2
NetQ5_1: Q5.1(B) R16.2 R17.2
NetQ6_1: Q6.1(B) R18.2 R21.2

Not connected (* = marked no-connect by the designer): J3 4; U1 4(RESET)* 6(SPI_CLK)* 7(SPI_MISO)* 8(SPI_MOSI)* 9(SPI_CS)* 11(USB_VBUS)* 12(USB_DN)* 13(USB_DP)* 16(USB_ID)* 21(SD_CMD)* 22(SD_DATA0)* 23(SD_DATA1)* 24(SD_DATA2)* 25(SD_DATA3)* 26(SD_CLK)* 27(SDIO_DATA1)* 28(SDIO_DATA2)* 29(SDIO_CMD)* 30(SDIO_DATA0)* 31(SDIO_DATA3)* 32(SDIO_CLK)* 33(GPIO3)* 34(GPIO6)* 35(HSIC_STROBE)* 36(HSIC_DATA)* 45(ISINK)* 46(ADC2)* 47(ADC1)* 48(SD_DET)* 49(STATUS)* 50(GPIO43)* 52(GPIO41)* 53(USIM_DET)* 59(AUX_ANT)* 62(VBAT)* 63(VBAT)* 66(RTS)* 67(CTS)* 70(DCD)* 73(PCM_OUT)* 74(PCM_IN)* 75(PCM_SYNC)* 76(PCM_CLK)* 79(GNSS_ANT)* 83(COEX1)* 84(COEX2)* 85(BOOT_CFG0)* 86(COEX3)* 87(GPIO77)*; U3 C6(VPP) CD*; U8 5(K4)

### Notes on the sheet
- GMS
- SIM7600

### Library data of the parts
C5 C6 = Tu tantalum 10uF 16V SMD3528: Dán; Don_Vi: Con; So_Chan: 2; Ten_Linh_Kien: Tụ tantalum 106C-10uF 16V SMD3528; Ma_Hang: MH007474; Chung_Loai: Dán; Kieu_Chan: *; ComponentLink1Description: New link; ComponentLink1URL: https://www.thegioiic.com/tu-tantalum-100uf-6-3v-1210-tajb107k006rnj
C7 = CMP-0687-00058-1: Aluminum Electrolytic Capacitor, UD Series, Low Impedance, 330 uF, 6.3 V, + / - 20%, -55 to 105 degC, Chip Type, 6.3 x 7.7 mm D x L, Pb-Free, Reel; PartNumber: UUD0J331MCL1GS; Manufacturer: Nichicon; Impedance: 0.34 Ohm; Rated Ripple Current (at 100kHz): 280 mA; Rated Voltage: 6.3 V; Packing: Dia382mm Reel; Rated Capacitance: 330 uF; Tolerance Rated Capacitance: -20 to 20%; Endurance Time: 2000 h; ComponentLink2Description: Datasheet; ComponentLink3URL: http://products.nichicon.co.jp/en/pdf/XJA043/e-ud.pdf; ComponentLink1Description: Manufacturer URL; Mounting Technology: Surface Mount; ComponentLink2URL: http://products.nichicon.co.jp/en/pdf/XJA043/e-ud.pdf; RoHS: TRUE; Diameter: 6.3 mm; PackageReference: CAPAE-D6.3H7.7; DatasheetVersion: 08/2012; ComponentLink1URL: http://www.nichicon.co.jp/; ComponentLink3Description: Package Specification; Length: 7.7 mm; PackageDescription: 2-Pin Surface Mount Device, Diameter 6.3 mm, Height 7.7 mm, Pitch 5.4 mm; ComponentLink4Description: New link; ComponentLink4URL: https://www.thegioiic.com/tu-nhom-smd-330uf-6-3v-6-3x7-7mm
C8 C25-C27 = Tu 0603 104 50V 10%: as C2 on sheet [2]_ARM; Chung_Loai: Dán; Kieu_Chan: *
C9 C28 = Tu 0603 105 16V 20%: as C1 on sheet [2]_ARM; Chung_Loai: Dán; Kieu_Chan: *
D6 = Diode S4: Dán; Ten_Linh_Kien: Diode S4 SOD123 ( 1N5819 SOD123); Ma_Hang: MH005519; Don_Vi: Con; Ghi_Chu: *; Chung_Loai: Dán; Kieu_Chan: *; ComponentLink1Description: New link; ComponentLink1URL: https://www.thegioiic.com/bzt52c5v1-diode-zener-5-1v-500mw
J3 = CMP-0275-00001-2: as J1 on sheet [2]_ARM; Mounting Technology: Surface Mount; PackageReference: RECE-20369-001E-01-4; ComponentLink1URL: http://www.taoglas.com/; Housing Color: Gold; DatasheetVersion: Rev. C; ComponentLink2URL: http://www.taoglas.com/images/product_images/original_images/RECE.20369.001E.01.pdf; ComponentLink3Description: Package Specification; PackageVersion: Rev. C; ComponentLink1Description: Manufacturer URL; ComponentLink2Description: Datasheet; PackageDescription: 4-Pin, Hand Drawn, Body 1.7x1.7mm; ComponentLink3URL: http://www.taoglas.com/images/product_images/original_images/RECE.20369.001E.01.pdf
L2 = LED 0805 Do: as L3 on sheet [1]_Power; Ghi_Chu: *; Kieu_Chan: *; Chung_Loai: Dán
Q3 Q5 Q6 = CMP-1177-00080-1: NPN Silicon AF Transistor, 45 V VCEO, 100 mA IC, SOT323, Reel, Green; Manufacturer: Infineon; VCEO (max): 45Â V; ICBO (max): 15Â nA; IBM (max): 200Â mA; Ptot (max): 250Â mW; Green: TRUE; VEBO (max): 6Â V; IC (max): 100Â mA; VCBO (max): 50Â V; fT (typ): 250Â MHz; Halogen-free: TRUE; Packing: Reel; Mounting Technology: Surface Mount; PackageReference: SOT323; PartNumber: BC847BW; PackageDescription: 3-Pin Small Outline Transistor Package, 1.25 x 2 mm Body, 0.65 mm Pitch; ICM (max): 200Â mA; ComponentLink3Description: Package Specification; ComponentLink1URL: http://www.infineon.com/; ComponentLink2Description: Datasheet; Polarity: NPN; ComponentLink2URL: http://www.infineon.com/dgdl/bc847series_bc848series_bc849series_bc850series.pdf?folderId=db3a304314dca389011541d30fa21656&fileId=db3a304314dca389011541d4630a1657; ComponentLink1Description: Manufacturer URL; ComponentLink3URL: http://www.infineon.com/dgdl/SOT323-Package_Overview.pdf?folderId=db3a30431936bc4b0119533e1dcb3c92&fileId=db3a30431936bc4b011953495f283cb1
Q4 Q7 = CMP-12801-000044-2: MOSFET N-CH 50V 500MA SOT23; Turn-On Delay Time: 2.93ns; Max Power Dissipation: 600mW; Drain to Source Resistance: 1.8R; Rise Time: 2.99ns; Turn-Off Delay Time: 9.45ns; Number of Elements: 1; Fall Time: 8.3ns; Gate to Source Voltage (Vgs): 20V; Element Configuration: Single; Input Capacitance: 40pF; Min Operating Temperature: -55°C; Lead Free: Lead Free; Contact Plating: Tin; Number of Pins: 3; Case/Package: SOT-23; Radiation Hardening: No; Drain to Source Voltage (Vdss): 50V; Continuous Drain Current (ID): 500mA; Max Operating Temperature: 150°C; Weight: 0.000282oz; Width: 1.4mm; Length: 3mm; Rds On Max: 1.8R; Height: 1mm; Mount: Surface Mount; Power Dissipation: 600mW; Package Quantity: 3000; Packaging: Tape and Reel; Number of Channels: 1; REACH SVHC: No SVHC
R5 R7 R8 = Tro 0603 5% 220R: Dán; Don_Vi: Con; So_Chan: 2; Ten_Linh_Kien: Trở 0603 5% 220R; Ma_Hang: MH006322; Chung_Loai: Dán; Kieu_Chan: *
R9 R11 R13-R16 R18-R20 = Tro 0603 5% 1k: Dán; Don_Vi: Con; So_Chan: 2; Ten_Linh_Kien: Trở 0603 5% 1k; Ma_Hang: MH006319; Chung_Loai: Dán; Kieu_Chan: *
R12 R17 R21 = Tro 0603 5% 100k: Dán; So_Chan: 2; Ten_Linh_Kien: Trở 0603 5% 100k; Ma_Hang: MH006314; Don_Vi: Con; Chung_Loai: Dán; Kieu_Chan: *
SW = SW_SPDT_2PIN: SMD Mini Push Button Switch 2 Pin 3x6x2.7mm; Manufacturer: OEM; Part number: SPST 2 PIN SMD; Cost: 600; ComponentLink1Description: Link product; ComponentLink1URL: https://www.thegioiic.com/nut-nhan-3-5x6mm-cao-2-5mm-2-chan-smd-dau-trang
U1 = SIMA7600C
U3 = Micro_Sim_7Pin: MS-PP-7P Khay Cắm Micro Sim 7 Chân Push-Push; Manufacturer: Samsung; Part number: C0805; Cost: 200; ComponentLink1Description: Link product; ComponentLink1URL: https://www.thegioiic.com/tu-gom-0805-1-5nf-50v; Package: 0805
U8 = CMP-1061-00157-1: 5-Line Transient Voltage Suppressor Array, 6-Pin SC70, Pb-Free, Tape and Reel; Manufacturer: On Semiconductor; PPK Max (W): 100; IR Max (uA): 5; Direction: Unidirectional; RoHS: Pb-Free; ComponentLink2URL: http://www.onsemi.com/pub_link/Collateral/SMF05C-D.PDF; DatasheetVersion: Rev. 4; PackageVersion: Rev. W; PackageReference: SC70-6-419B-02_W; PartNumber: SMF05CT2G; PackageDescription: 6-Pin Small Outline Transistor, Body 2 x 1.25 mm, Pitch 0.65 mm; Mounting Technology: Surface Mount; ComponentLink3URL: http://www.onsemi.com/pub_link/Collateral/SMF05C-D.PDF; ComponentLink2Description: Datasheet; ComponentLink3Description: Package Specification; Packing: Tape and Reel; ComponentLink1Description: Manufacturer URL; ComponentLink1URL: http://www.onsemi.com/
U9 U10 = CMP-0859-00206-4: IC TRNSLTR BIDIRECTIONAL SOT23-6; Number of Inputs: 1; Logic Function: Translator; Min Supply Voltage: 1.65V; Quiescent Current: 3uA; Turn-On Delay Time: 36.2ns; Max Supply Voltage: 5.5V; Polarity: Non-Inverting; Propagation Delay: 3.9ns; Low Level Output Current: 32mA; Data Rate: 420Mbps; High Level Output Current: -32mA; Number of Bits: 1; Max Operating Temperature: 85°C; Mount: Surface Mount; Lead Free: Lead Free; Number of Elements: 1; Package Quantity: 3000; Number of Pins: 6; Width: 1.3mm; Min Operating Temperature: -40°C; REACH SVHC: No SVHC; Weight: 0.000229oz; Contact Plating: Gold; Height: 1.75mm; Direction: Bidirectional; Number of Channels: 1; Length: 3.05mm; Packaging: Tape and Reel; Radiation Hardening: No; Case/Package: SOT-23

## Nets that join several sheets
+3V3: [1]_Power (L5.2 R35.2), [2]_ARM (9 pins), [3]_I2C_TO_UART (14 pins), [4]_SIM (R14.2 R20.2 U9.1 U10.6)
GND: [1]_Power (21 pins), [2]_ARM (27 pins), [3]_I2C_TO_UART (14 pins), [4]_SIM (44 pins)
GMS_RP_RX: [3]_I2C_TO_UART (U5.23), [4]_SIM (U10.4)
GMS_RP_TX: [3]_I2C_TO_UART (U5.24), [4]_SIM (U9.3)
GPS_RX: [2]_ARM (U2.1), [3]_I2C_TO_UART (U4.23)
GPS_TX: [2]_ARM (U2.2), [3]_I2C_TO_UART (U4.24)
SCL: [2]_ARM (P1.5), [3]_I2C_TO_UART (R24.2 R26.2 U4.9 U5.9)
SDA: [2]_ARM (P1.3), [3]_I2C_TO_UART (R25.2 R27.2 U4.10 U5.10)